# Altium schematic sheet SPI_Board.SchDoc
size 635 x 495 mm
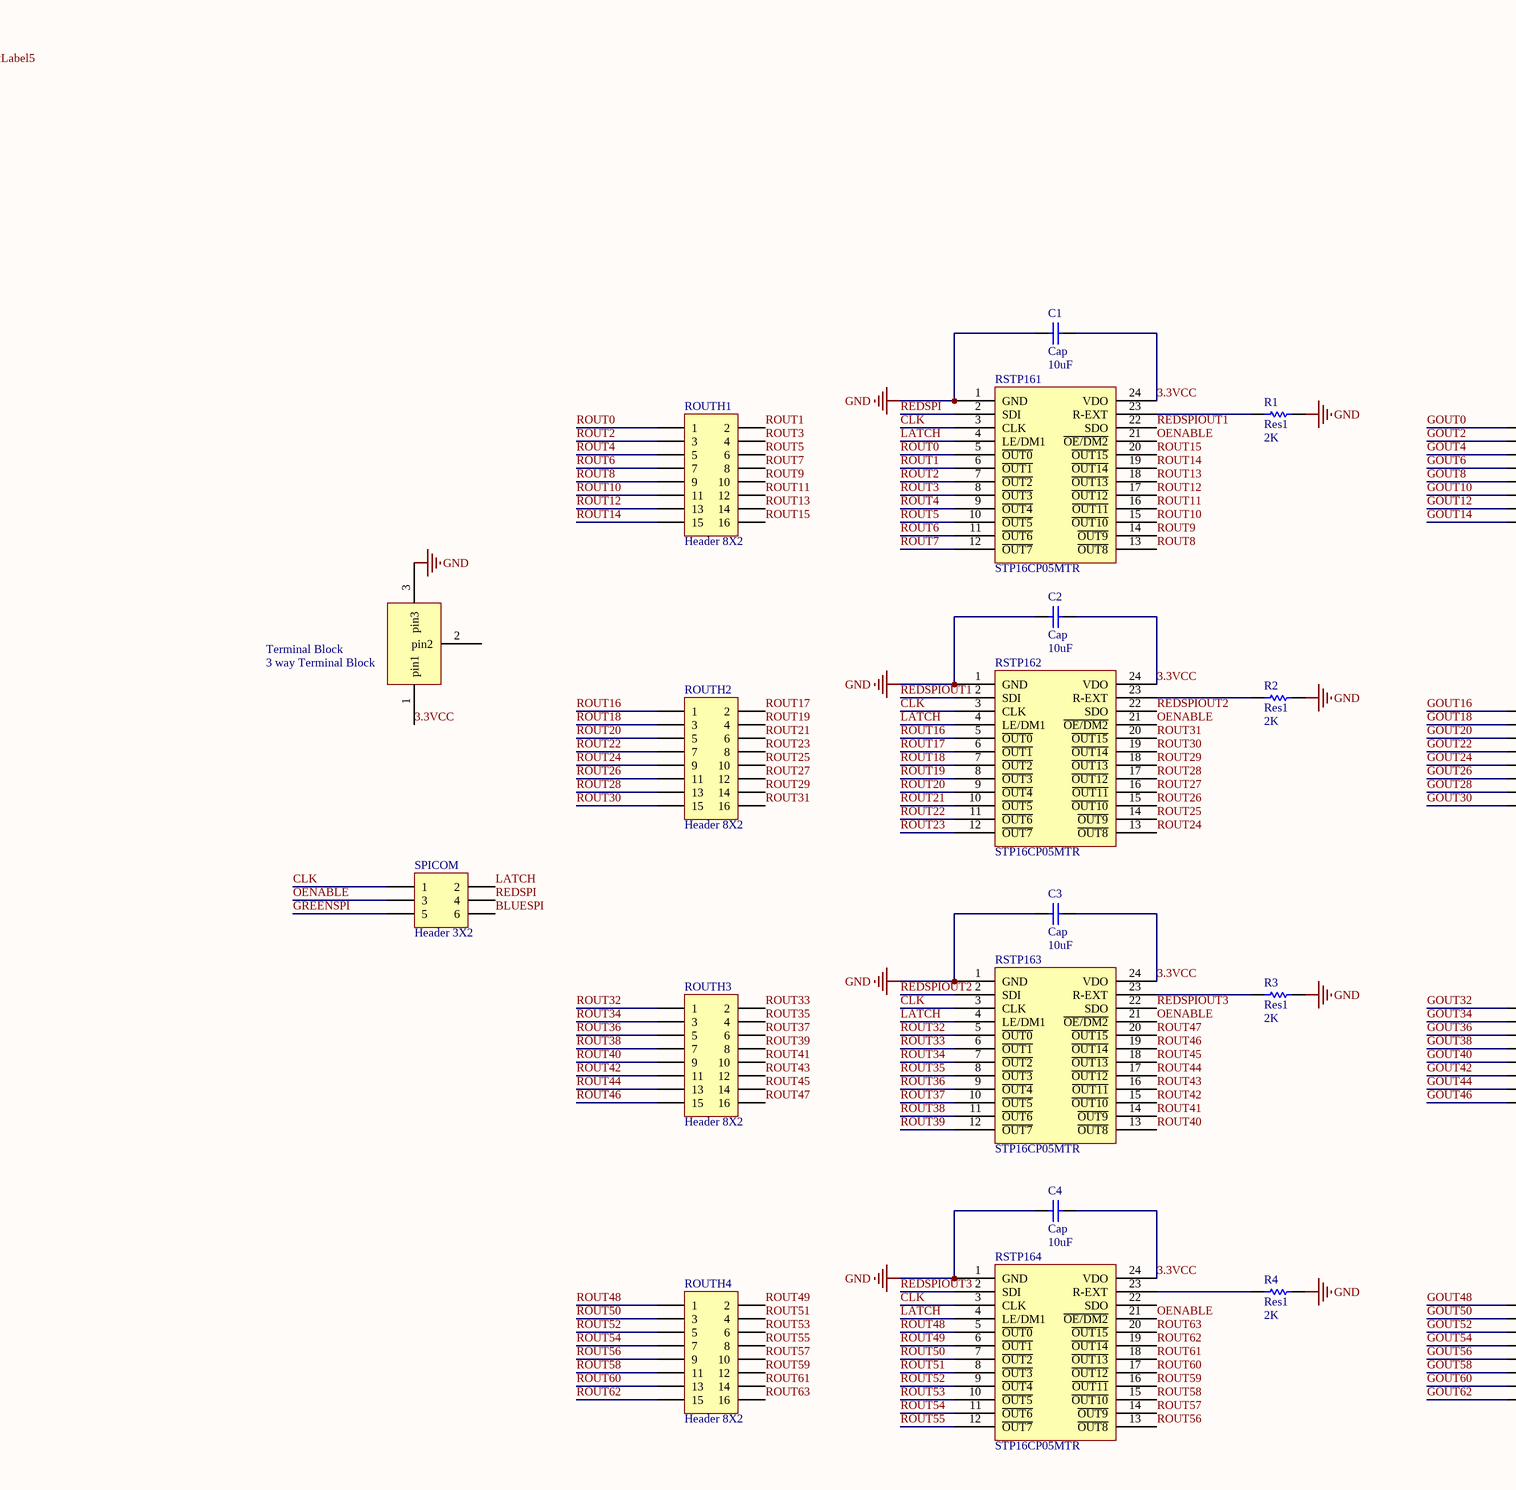
[diagram p0: SPI_Board.SchDoc, left]
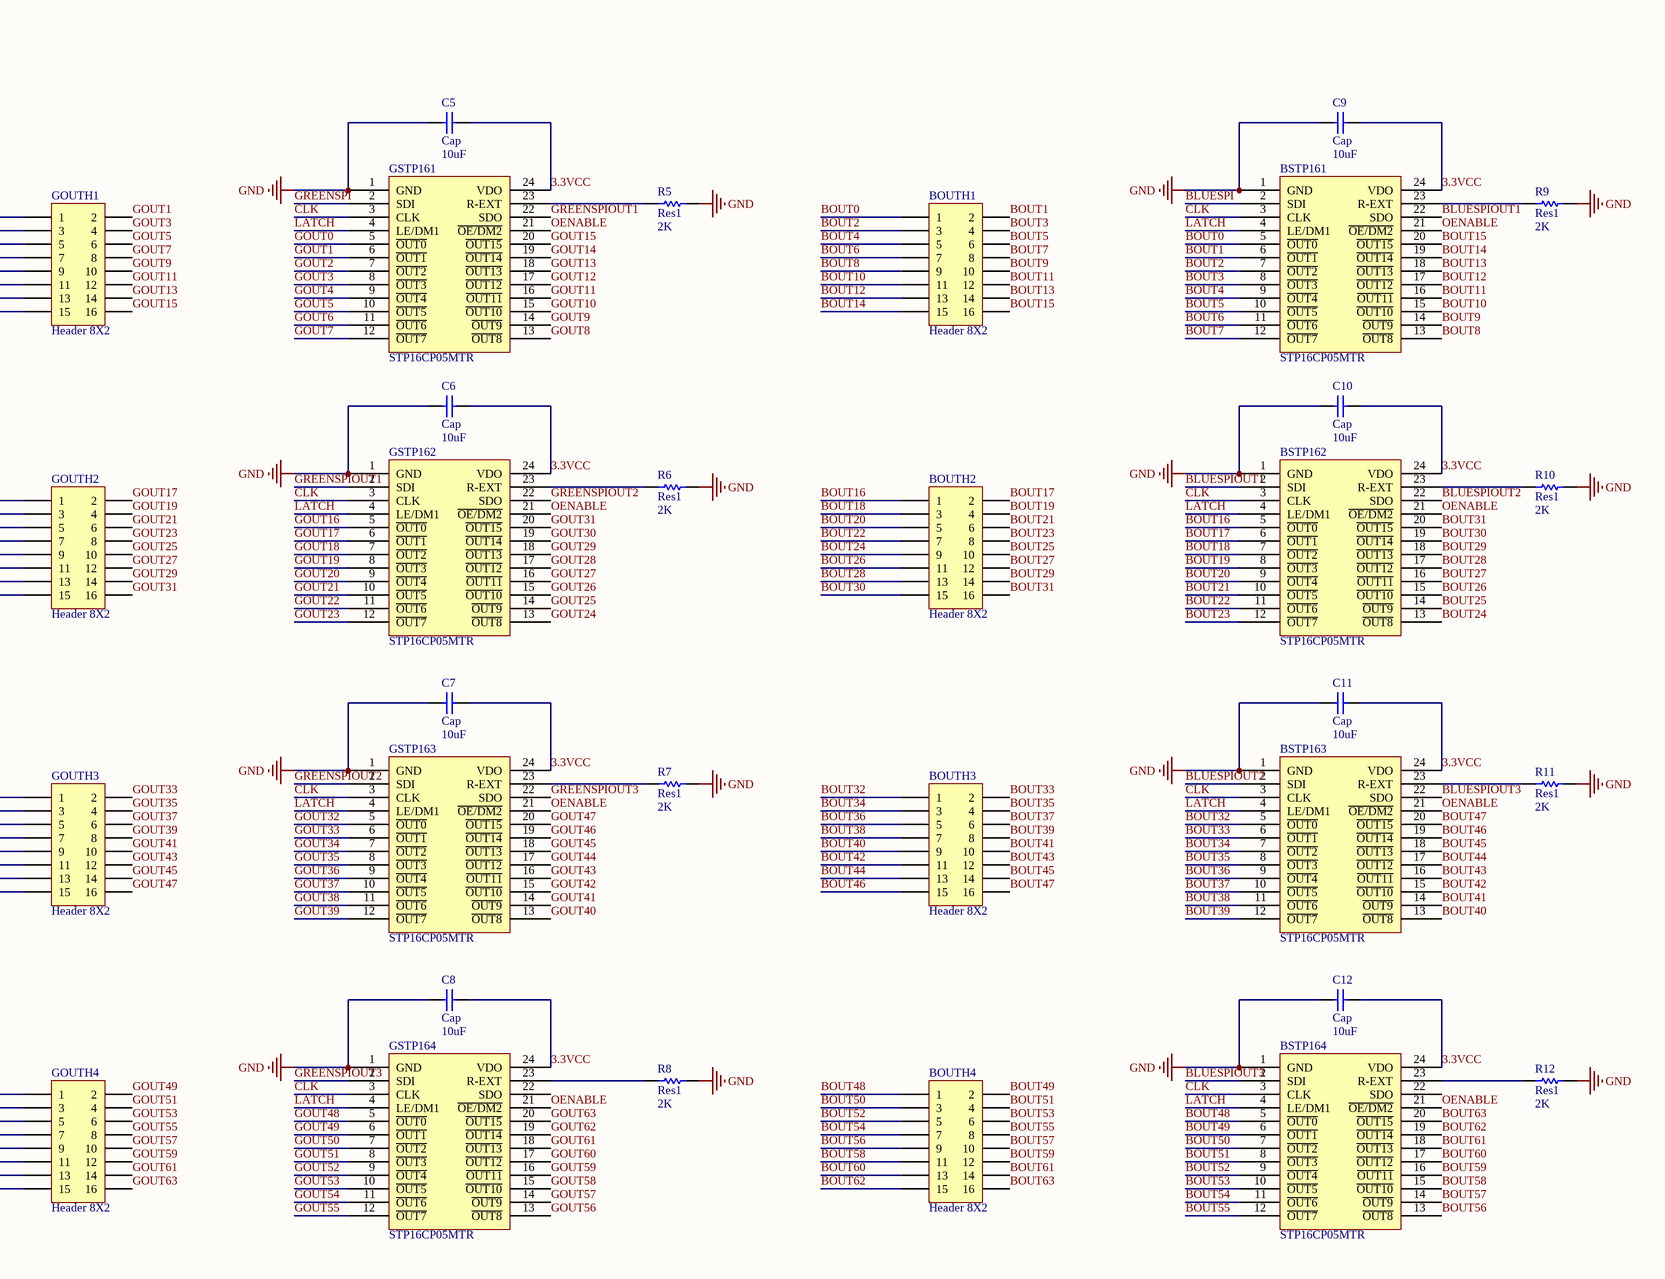
[diagram p1: SPI_Board.SchDoc, right]

## Parts
BOUTH1  Header 8X2  [HDR2X8]
BOUTH2  Header 8X2  [HDR2X8]
BOUTH3  Header 8X2  [HDR2X8]
BOUTH4  Header 8X2  [HDR2X8]
BSTP161  STP16CP05MTR  [STP16CP05MTR-24N]
BSTP162  STP16CP05MTR  [STP16CP05MTR-24N]
BSTP163  STP16CP05MTR  [STP16CP05MTR-24N]
BSTP164  STP16CP05MTR  [STP16CP05MTR-24N]
C1  Cap  value 10uF  [RAD0.2A]
C2  Cap  value 10uF  [RAD0.2A]
C3  Cap  value 10uF  [RAD0.2A]
C4  Cap  value 10uF  [RAD0.2A]
C5  Cap  value 10uF  [RAD0.2A]
C6  Cap  value 10uF  [RAD0.2A]
C7  Cap  value 10uF  [RAD0.2A]
C8  Cap  value 10uF  [RAD0.2A]
C9  Cap  value 10uF  [RAD0.2A]
C10  Cap  value 10uF  [RAD0.2A]
C11  Cap  value 10uF  [RAD0.2A]
C12  Cap  value 10uF  [RAD0.2A]
GOUTH1  Header 8X2  [HDR2X8]
GOUTH2  Header 8X2  [HDR2X8]
GOUTH3  Header 8X2  [HDR2X8]
GOUTH4  Header 8X2  [HDR2X8]
GSTP161  STP16CP05MTR  [STP16CP05MTR-24N]
GSTP162  STP16CP05MTR  [STP16CP05MTR-24N]
GSTP163  STP16CP05MTR  [STP16CP05MTR-24N]
GSTP164  STP16CP05MTR  [STP16CP05MTR-24N]
R1  Res1  value 2K  [AXIAL0.4]
R2  Res1  value 2K  [AXIAL0.4]
R3  Res1  value 2K  [AXIAL0.4]
R4  Res1  value 2K  [AXIAL0.4]
R5  Res1  value 2K  [AXIAL0.4]
R6  Res1  value 2K  [AXIAL0.4]
R7  Res1  value 2K  [AXIAL0.4]
R8  Res1  value 2K  [AXIAL0.4]
R9  Res1  value 2K  [AXIAL0.4]
R10  Res1  value 2K  [AXIAL0.4]
R11  Res1  value 2K  [AXIAL0.4]
R12  Res1  value 2K  [AXIAL0.4]
ROUTH1  Header 8X2  [HDR2X8]
ROUTH2  Header 8X2  [HDR2X8]
ROUTH3  Header 8X2  [HDR2X8]
ROUTH4  Header 8X2  [HDR2X8]
RSTP161  STP16CP05MTR  [STP16CP05MTR-24N]
RSTP162  STP16CP05MTR  [STP16CP05MTR-24N]
RSTP163  STP16CP05MTR  [STP16CP05MTR-24N]
RSTP164  STP16CP05MTR  [STP16CP05MTR-24N]
SPICOM  Header 3X2  [HDR2X3]
Terminal_Block  3 way Terminal Block  [PCTB3N]

## Nets
GND: BSTP161.1(GND) BSTP162.1(GND) BSTP163.1(GND) BSTP164.1(GND) C1.1 C2.1 C3.1 C4.1 C5.1 C6.1 C7.1 C8.1 C9.1 C10.1 C11.1 C12.1 GSTP161.1(GND) GSTP162.1(GND) GSTP163.1(GND) GSTP164.1(GND) R1.2 R2.2 R3.2 R4.2 R5.2 R6.2 R7.2 R8.2 R9.2 R10.2 R11.2 R12.2 RSTP161.1(GND) RSTP162.1(GND) RSTP163.1(GND) RSTP164.1(GND) Terminal_Block.3(pin3)
3.3VCC: BSTP161.24(VDO) BSTP162.24(VDO) BSTP163.24(VDO) BSTP164.24(VDO) C1.2 C2.2 C3.2 C4.2 C5.2 C6.2 C7.2 C8.2 C9.2 C10.2 C11.2 C12.2 GSTP161.24(VDO) GSTP162.24(VDO) GSTP163.24(VDO) GSTP164.24(VDO) RSTP161.24(VDO) RSTP162.24(VDO) RSTP163.24(VDO) RSTP164.24(VDO) Terminal_Block.1(pin1)
BLUESPI: BSTP161.2(SDI) SPICOM.6
BLUESPIOUT1: BSTP161.22(SDO) BSTP162.2(SDI)
BLUESPIOUT2: BSTP162.22(SDO) BSTP163.2(SDI)
BLUESPIOUT3: BSTP163.22(SDO) BSTP164.2(SDI)
BOUT0: BOUTH1.1 BSTP161.5(~{OUT0})
BOUT1: BOUTH1.2 BSTP161.6(~{OUT1})
BOUT2: BOUTH1.3 BSTP161.7(~{OUT2})
BOUT3: BOUTH1.4 BSTP161.8(~{OUT3})
BOUT4: BOUTH1.5 BSTP161.9(~{OUT4})
BOUT5: BOUTH1.6 BSTP161.10(~{OUT5})
BOUT6: BOUTH1.7 BSTP161.11(~{OUT6})
BOUT7: BOUTH1.8 BSTP161.12(~{OUT7})
BOUT8: BOUTH1.9 BSTP161.13(~{OUT8})
BOUT9: BOUTH1.10 BSTP161.14(~{OUT9})
BOUT10: BOUTH1.11 BSTP161.15(~{OUT10})
BOUT11: BOUTH1.12 BSTP161.16(~{OUT11})
BOUT12: BOUTH1.13 BSTP161.17(~{OUT12})
BOUT13: BOUTH1.14 BSTP161.18(~{OUT13})
BOUT14: BOUTH1.15 BSTP161.19(~{OUT14})
BOUT15: BOUTH1.16 BSTP161.20(~{OUT15})
BOUT16: BOUTH2.1 BSTP162.5(~{OUT0})
BOUT17: BOUTH2.2 BSTP162.6(~{OUT1})
BOUT18: BOUTH2.3 BSTP162.7(~{OUT2})
BOUT19: BOUTH2.4 BSTP162.8(~{OUT3})
BOUT20: BOUTH2.5 BSTP162.9(~{OUT4})
BOUT21: BOUTH2.6 BSTP162.10(~{OUT5})
BOUT22: BOUTH2.7 BSTP162.11(~{OUT6})
BOUT23: BOUTH2.8 BSTP162.12(~{OUT7})
BOUT24: BOUTH2.9 BSTP162.13(~{OUT8})
BOUT25: BOUTH2.10 BSTP162.14(~{OUT9})
BOUT26: BOUTH2.11 BSTP162.15(~{OUT10})
BOUT27: BOUTH2.12 BSTP162.16(~{OUT11})
BOUT28: BOUTH2.13 BSTP162.17(~{OUT12})
BOUT29: BOUTH2.14 BSTP162.18(~{OUT13})
BOUT30: BOUTH2.15 BSTP162.19(~{OUT14})
BOUT31: BOUTH2.16 BSTP162.20(~{OUT15})
BOUT32: BOUTH3.1 BSTP163.5(~{OUT0})
BOUT33: BOUTH3.2 BSTP163.6(~{OUT1})
BOUT34: BOUTH3.3 BSTP163.7(~{OUT2})
BOUT35: BOUTH3.4 BSTP163.8(~{OUT3})
BOUT36: BOUTH3.5 BSTP163.9(~{OUT4})
BOUT37: BOUTH3.6 BSTP163.10(~{OUT5})
BOUT38: BOUTH3.7 BSTP163.11(~{OUT6})
BOUT39: BOUTH3.8 BSTP163.12(~{OUT7})
BOUT40: BOUTH3.9 BSTP163.13(~{OUT8})
BOUT41: BOUTH3.10 BSTP163.14(~{OUT9})
BOUT42: BOUTH3.11 BSTP163.15(~{OUT10})
BOUT43: BOUTH3.12 BSTP163.16(~{OUT11})
BOUT44: BOUTH3.13 BSTP163.17(~{OUT12})
BOUT45: BOUTH3.14 BSTP163.18(~{OUT13})
BOUT46: BOUTH3.15 BSTP163.19(~{OUT14})
BOUT47: BOUTH3.16 BSTP163.20(~{OUT15})
BOUT48: BOUTH4.1 BSTP164.5(~{OUT0})
BOUT49: BOUTH4.2 BSTP164.6(~{OUT1})
BOUT50: BOUTH4.3 BSTP164.7(~{OUT2})
BOUT51: BOUTH4.4 BSTP164.8(~{OUT3})
BOUT52: BOUTH4.5 BSTP164.9(~{OUT4})
BOUT53: BOUTH4.6 BSTP164.10(~{OUT5})
BOUT54: BOUTH4.7 BSTP164.11(~{OUT6})
BOUT55: BOUTH4.8 BSTP164.12(~{OUT7})
BOUT56: BOUTH4.9 BSTP164.13(~{OUT8})
BOUT57: BOUTH4.10 BSTP164.14(~{OUT9})
BOUT58: BOUTH4.11 BSTP164.15(~{OUT10})
BOUT59: BOUTH4.12 BSTP164.16(~{OUT11})
BOUT60: BOUTH4.13 BSTP164.17(~{OUT12})
BOUT61: BOUTH4.14 BSTP164.18(~{OUT13})
BOUT62: BOUTH4.15 BSTP164.19(~{OUT14})
BOUT63: BOUTH4.16 BSTP164.20(~{OUT15})
CLK: BSTP161.3(CLK) BSTP162.3(CLK) BSTP163.3(CLK) BSTP164.3(CLK) GSTP161.3(CLK) GSTP162.3(CLK) GSTP163.3(CLK) GSTP164.3(CLK) RSTP161.3(CLK) RSTP162.3(CLK) RSTP163.3(CLK) RSTP164.3(CLK) SPICOM.1
GOUT0: GOUTH1.1 GSTP161.5(~{OUT0})
GOUT1: GOUTH1.2 GSTP161.6(~{OUT1})
GOUT2: GOUTH1.3 GSTP161.7(~{OUT2})
GOUT3: GOUTH1.4 GSTP161.8(~{OUT3})
GOUT4: GOUTH1.5 GSTP161.9(~{OUT4})
GOUT5: GOUTH1.6 GSTP161.10(~{OUT5})
GOUT6: GOUTH1.7 GSTP161.11(~{OUT6})
GOUT7: GOUTH1.8 GSTP161.12(~{OUT7})
GOUT8: GOUTH1.9 GSTP161.13(~{OUT8})
GOUT9: GOUTH1.10 GSTP161.14(~{OUT9})
GOUT10: GOUTH1.11 GSTP161.15(~{OUT10})
GOUT11: GOUTH1.12 GSTP161.16(~{OUT11})
GOUT12: GOUTH1.13 GSTP161.17(~{OUT12})
GOUT13: GOUTH1.14 GSTP161.18(~{OUT13})
GOUT14: GOUTH1.15 GSTP161.19(~{OUT14})
GOUT15: GOUTH1.16 GSTP161.20(~{OUT15})
GOUT16: GOUTH2.1 GSTP162.5(~{OUT0})
GOUT17: GOUTH2.2 GSTP162.6(~{OUT1})
GOUT18: GOUTH2.3 GSTP162.7(~{OUT2})
GOUT19: GOUTH2.4 GSTP162.8(~{OUT3})
GOUT20: GOUTH2.5 GSTP162.9(~{OUT4})
GOUT21: GOUTH2.6 GSTP162.10(~{OUT5})
GOUT22: GOUTH2.7 GSTP162.11(~{OUT6})
GOUT23: GOUTH2.8 GSTP162.12(~{OUT7})
GOUT24: GOUTH2.9 GSTP162.13(~{OUT8})
GOUT25: GOUTH2.10 GSTP162.14(~{OUT9})
GOUT26: GOUTH2.11 GSTP162.15(~{OUT10})
GOUT27: GOUTH2.12 GSTP162.16(~{OUT11})
GOUT28: GOUTH2.13 GSTP162.17(~{OUT12})
GOUT29: GOUTH2.14 GSTP162.18(~{OUT13})
GOUT30: GOUTH2.15 GSTP162.19(~{OUT14})
GOUT31: GOUTH2.16 GSTP162.20(~{OUT15})
GOUT32: GOUTH3.1 GSTP163.5(~{OUT0})
GOUT33: GOUTH3.2 GSTP163.6(~{OUT1})
GOUT34: GOUTH3.3 GSTP163.7(~{OUT2})
GOUT35: GOUTH3.4 GSTP163.8(~{OUT3})
GOUT36: GOUTH3.5 GSTP163.9(~{OUT4})
GOUT37: GOUTH3.6 GSTP163.10(~{OUT5})
GOUT38: GOUTH3.7 GSTP163.11(~{OUT6})
GOUT39: GOUTH3.8 GSTP163.12(~{OUT7})
GOUT40: GOUTH3.9 GSTP163.13(~{OUT8})
GOUT41: GOUTH3.10 GSTP163.14(~{OUT9})
GOUT42: GOUTH3.11 GSTP163.15(~{OUT10})
GOUT43: GOUTH3.12 GSTP163.16(~{OUT11})
GOUT44: GOUTH3.13 GSTP163.17(~{OUT12})
GOUT45: GOUTH3.14 GSTP163.18(~{OUT13})
GOUT46: GOUTH3.15 GSTP163.19(~{OUT14})
GOUT47: GOUTH3.16 GSTP163.20(~{OUT15})
GOUT48: GOUTH4.1 GSTP164.5(~{OUT0})
GOUT49: GOUTH4.2 GSTP164.6(~{OUT1})
GOUT50: GOUTH4.3 GSTP164.7(~{OUT2})
GOUT51: GOUTH4.4 GSTP164.8(~{OUT3})
GOUT52: GOUTH4.5 GSTP164.9(~{OUT4})
GOUT53: GOUTH4.6 GSTP164.10(~{OUT5})
GOUT54: GOUTH4.7 GSTP164.11(~{OUT6})
GOUT55: GOUTH4.8 GSTP164.12(~{OUT7})
GOUT56: GOUTH4.9 GSTP164.13(~{OUT8})
GOUT57: GOUTH4.10 GSTP164.14(~{OUT9})
GOUT58: GOUTH4.11 GSTP164.15(~{OUT10})
GOUT59: GOUTH4.12 GSTP164.16(~{OUT11})
GOUT60: GOUTH4.13 GSTP164.17(~{OUT12})
GOUT61: GOUTH4.14 GSTP164.18(~{OUT13})
GOUT62: GOUTH4.15 GSTP164.19(~{OUT14})
GOUT63: GOUTH4.16 GSTP164.20(~{OUT15})
GREENSPI: GSTP161.2(SDI) SPICOM.5
GREENSPIOUT1: GSTP161.22(SDO) GSTP162.2(SDI)
GREENSPIOUT2: GSTP162.22(SDO) GSTP163.2(SDI)
GREENSPIOUT3: GSTP163.22(SDO) GSTP164.2(SDI)
LATCH: BSTP161.4(LE/DM1) BSTP162.4(LE/DM1) BSTP163.4(LE/DM1) BSTP164.4(LE/DM1) GSTP161.4(LE/DM1) GSTP162.4(LE/DM1) GSTP163.4(LE/DM1) GSTP164.4(LE/DM1) RSTP161.4(LE/DM1) RSTP162.4(LE/DM1) RSTP163.4(LE/DM1) RSTP164.4(LE/DM1) SPICOM.2
OENABLE: BSTP161.21(~{OE/DM2}) BSTP162.21(~{OE/DM2}) BSTP163.21(~{OE/DM2}) BSTP164.21(~{OE/DM2}) GSTP161.21(~{OE/DM2}) GSTP162.21(~{OE/DM2}) GSTP163.21(~{OE/DM2}) GSTP164.21(~{OE/DM2}) RSTP161.21(~{OE/DM2}) RSTP162.21(~{OE/DM2}) RSTP163.21(~{OE/DM2}) RSTP164.21(~{OE/DM2}) SPICOM.3
REDSPI: RSTP161.2(SDI) SPICOM.4
REDSPIOUT1: RSTP161.22(SDO) RSTP162.2(SDI)
REDSPIOUT2: RSTP162.22(SDO) RSTP163.2(SDI)
REDSPIOUT3: RSTP163.22(SDO) RSTP164.2(SDI)
ROUT0: ROUTH1.1 RSTP161.5(~{OUT0})
ROUT1: ROUTH1.2 RSTP161.6(~{OUT1})
ROUT2: ROUTH1.3 RSTP161.7(~{OUT2})
ROUT3: ROUTH1.4 RSTP161.8(~{OUT3})
ROUT4: ROUTH1.5 RSTP161.9(~{OUT4})
ROUT5: ROUTH1.6 RSTP161.10(~{OUT5})
ROUT6: ROUTH1.7 RSTP161.11(~{OUT6})
ROUT7: ROUTH1.8 RSTP161.12(~{OUT7})
ROUT8: ROUTH1.9 RSTP161.13(~{OUT8})
ROUT9: ROUTH1.10 RSTP161.14(~{OUT9})
ROUT10: ROUTH1.11 RSTP161.15(~{OUT10})
ROUT11: ROUTH1.12 RSTP161.16(~{OUT11})
ROUT12: ROUTH1.13 RSTP161.17(~{OUT12})
ROUT13: ROUTH1.14 RSTP161.18(~{OUT13})
ROUT14: ROUTH1.15 RSTP161.19(~{OUT14})
ROUT15: ROUTH1.16 RSTP161.20(~{OUT15})
ROUT16: ROUTH2.1 RSTP162.5(~{OUT0})
ROUT17: ROUTH2.2 RSTP162.6(~{OUT1})
ROUT18: ROUTH2.3 RSTP162.7(~{OUT2})
ROUT19: ROUTH2.4 RSTP162.8(~{OUT3})
ROUT20: ROUTH2.5 RSTP162.9(~{OUT4})
ROUT21: ROUTH2.6 RSTP162.10(~{OUT5})
ROUT22: ROUTH2.7 RSTP162.11(~{OUT6})
ROUT23: ROUTH2.8 RSTP162.12(~{OUT7})
ROUT24: ROUTH2.9 RSTP162.13(~{OUT8})
ROUT25: ROUTH2.10 RSTP162.14(~{OUT9})
ROUT26: ROUTH2.11 RSTP162.15(~{OUT10})
ROUT27: ROUTH2.12 RSTP162.16(~{OUT11})
ROUT28: ROUTH2.13 RSTP162.17(~{OUT12})
ROUT29: ROUTH2.14 RSTP162.18(~{OUT13})
ROUT30: ROUTH2.15 RSTP162.19(~{OUT14})
ROUT31: ROUTH2.16 RSTP162.20(~{OUT15})
ROUT32: ROUTH3.1 RSTP163.5(~{OUT0})
ROUT33: ROUTH3.2 RSTP163.6(~{OUT1})
ROUT34: ROUTH3.3 RSTP163.7(~{OUT2})
ROUT35: ROUTH3.4 RSTP163.8(~{OUT3})
ROUT36: ROUTH3.5 RSTP163.9(~{OUT4})
ROUT37: ROUTH3.6 RSTP163.10(~{OUT5})
ROUT38: ROUTH3.7 RSTP163.11(~{OUT6})
ROUT39: ROUTH3.8 RSTP163.12(~{OUT7})
ROUT40: ROUTH3.9 RSTP163.13(~{OUT8})
ROUT41: ROUTH3.10 RSTP163.14(~{OUT9})
ROUT42: ROUTH3.11 RSTP163.15(~{OUT10})
ROUT43: ROUTH3.12 RSTP163.16(~{OUT11})
ROUT44: ROUTH3.13 RSTP163.17(~{OUT12})
ROUT45: ROUTH3.14 RSTP163.18(~{OUT13})
ROUT46: ROUTH3.15 RSTP163.19(~{OUT14})
ROUT47: ROUTH3.16 RSTP163.20(~{OUT15})
ROUT48: ROUTH4.1 RSTP164.5(~{OUT0})
ROUT49: ROUTH4.2 RSTP164.6(~{OUT1})
ROUT50: ROUTH4.3 RSTP164.7(~{OUT2})
ROUT51: ROUTH4.4 RSTP164.8(~{OUT3})
ROUT52: ROUTH4.5 RSTP164.9(~{OUT4})
ROUT53: ROUTH4.6 RSTP164.10(~{OUT5})
ROUT54: ROUTH4.7 RSTP164.11(~{OUT6})
ROUT55: ROUTH4.8 RSTP164.12(~{OUT7})
ROUT56: ROUTH4.9 RSTP164.13(~{OUT8})
ROUT57: ROUTH4.10 RSTP164.14(~{OUT9})
ROUT58: ROUTH4.11 RSTP164.15(~{OUT10})
ROUT59: ROUTH4.12 RSTP164.16(~{OUT11})
ROUT60: ROUTH4.13 RSTP164.17(~{OUT12})
ROUT61: ROUTH4.14 RSTP164.18(~{OUT13})
ROUT62: ROUTH4.15 RSTP164.19(~{OUT14})
ROUT63: ROUTH4.16 RSTP164.20(~{OUT15})
NetBSTP161_23: BSTP161.23(R-EXT) R9.1
NetBSTP162_23: BSTP162.23(R-EXT) R10.1
NetBSTP163_23: BSTP163.23(R-EXT) R11.1
NetBSTP164_23: BSTP164.23(R-EXT) R12.1
NetGSTP161_23: GSTP161.23(R-EXT) R5.1
NetGSTP162_23: GSTP162.23(R-EXT) R6.1
NetGSTP163_23: GSTP163.23(R-EXT) R7.1
NetGSTP164_23: GSTP164.23(R-EXT) R8.1
NetR1_1: R1.1 RSTP161.23(R-EXT)
NetR2_1: R2.1 RSTP162.23(R-EXT)
NetR3_1: R3.1 RSTP163.23(R-EXT)
NetR4_1: R4.1 RSTP164.23(R-EXT)

Not connected (* = marked no-connect by the designer): BSTP164 22(SDO); GSTP164 22(SDO); RSTP164 22(SDO); Terminal_Block 2(pin2)

## Notes on the sheet
- Labels drawn without touching a wire or pin: NetLabel5

## Library data of the parts
BOUTH1-BOUTH4 GOUTH1-GOUTH4 ROUTH1-ROUTH4 = Header 8X2: Header, 8-Pin, Dual row; LatestRevisionDate: 17-Jul-2002; LatestRevisionNote: Re-released for DXP Platform.; Publisher: Altium Limited
C1-C12 = Cap: Capacitor; Published: 8-Jun-2000; LatestRevisionDate: 17-Jul-2002; LatestRevisionNote: Re-released for DXP Platform.; PackageReference: RAD-0.3; Publisher: Altium Limited; PackageDescription: Radial Cap, Thru-Hole; 2 Leads; 0.3 in Pin Spacing
R1-R12 = Res1: Resistor; Published: 8-Jun-2000; LatestRevisionDate: 17-Jul-2002; LatestRevisionNote: Re-released for DXP Platform.; PackageReference: AXIAL-0.3; Publisher: Altium Limited; PackageDescription: Axial Device, Thru-Hole; 2 Leads; 0.3 in Pin Spacing
SPICOM = Header 3X2: Header, 3-Pin, Dual row; LatestRevisionDate: 17-Jul-2002; LatestRevisionNote: Re-released for DXP Platform.; Publisher: Altium Limited
Terminal_Block = Component_1